# EAGLE schematic ARD_SHIELD (EAGLE 7.6.0)
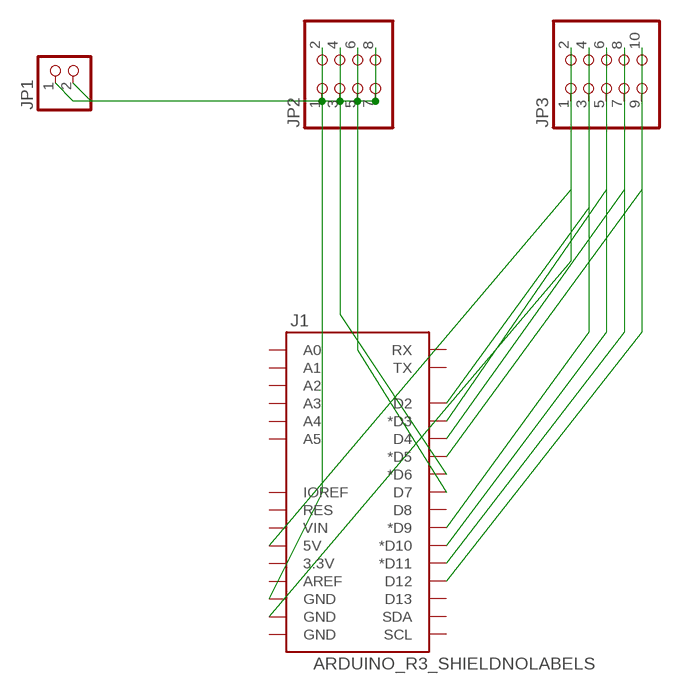
[diagram p0: schematic, sheet 1]

## Parts
J1  ARDUINO_R3_SHIELDNOLABELS  [UNO_R3_SHIELD_NOLABELS]
JP1  PINHD-1X2  [1X02]
JP2  PINHD-2X4  [2X04]
JP3  PINHD-2X5  [2X05]

## Nets
N$1: J1.GND@2(GND) JP1.2 JP2.1 JP2.2
N$2: J1.D6(*D6) JP2.3 JP2.4
N$3: J1.D7 JP2.5 JP2.6
N$4: JP1.1 JP2.7 JP2.8
N$5: J1.5V JP3.1
N$6: J1.GND@1(GND) JP3.2
N$7: J1.D9(*D9) JP3.3
N$8: J1.D10(*D10) JP3.5
N$9: J1.D11(*D11) JP3.7
N$10: J1.D12 JP3.9
N$11: J1.D2 JP3.4
N$12: J1.D3(*D3) JP3.6
N$13: J1.D4 JP3.8
N$14: J1.D5(*D5) JP3.10
Unconnected: J1.3.3V J1.A0 J1.A1 J1.A2 J1.A3 J1.A4 J1.A5 J1.AREF J1.D8 J1.D13 J1.GND@0(GND) J1.IOREF J1.RES J1.RX J1.SCL J1.SDA J1.TX J1.VIN

## Library data of the parts
J1 = SparkFun-Boards:ARDUINO_R3_SHIELD: Shield form compatible with the Arduino Uno R3.
JP1 = pinhead:PINHD-1X2: PIN HEADER
JP2 = pinhead:PINHD-2X4: PIN HEADER
JP3 = pinhead:PINHD-2X5: PIN HEADER

## Net classes
0 default: width 0.203 mm, drill 0.203 mm, clearance 0.203 mm